# EAGLE schematic GH_Terra_pre_rf (EAGLE 6.5.0)
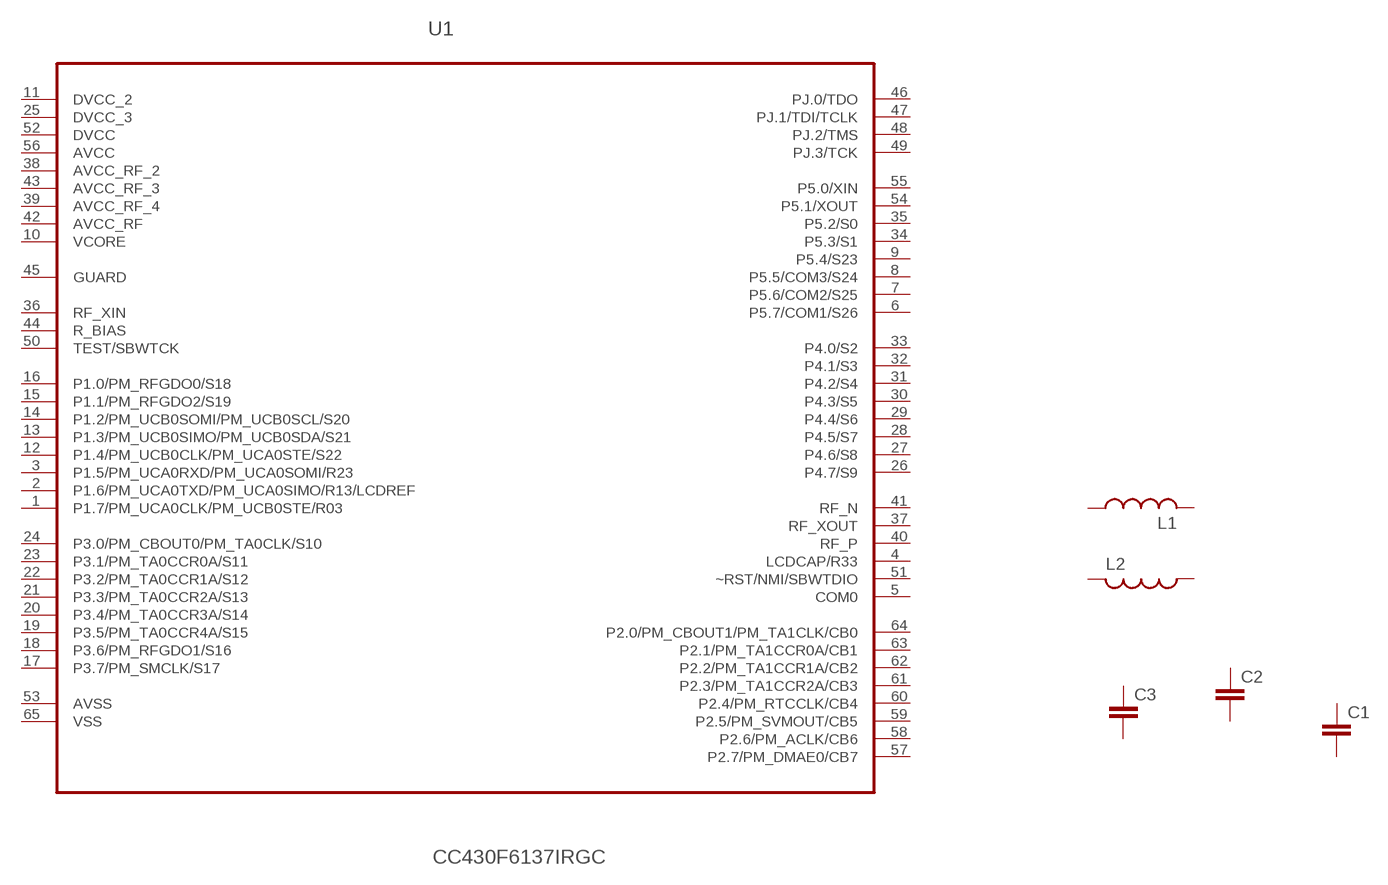
[diagram p0: schematic, sheet 1]

## Parts
C1  C-EUC0603  [C0603_IPC]
C2  C-EUC0603  [C0603_IPC]
C3  C-EUC0603  [C0603_IPC]
L1  L-USL0402  [L0402_IPC]
L2  L-USL0402  [L0402_IPC]
U1  CC430F6137IRGC  [QFN50P900X900X100-65N]
Unconnected: C1.1 C1.2 C2.1 C2.2 C3.1 C3.2 L1.1 L1.2 L2.1 L2.2 U1.1(P1.7/PM_UCA0CLK/PM_UCB0STE/R03) U1.2(P1.6/PM_UCA0TXD/PM_UCA0SIMO/R13/LCDREF) U1.3(P1.5/PM_UCA0RXD/PM_UCA0SOMI/R23) U1.4(LCDCAP/R33) U1.5(COM0) U1.6(P5.7/COM1/S26) U1.7(P5.6/COM2/S25) U1.8(P5.5/COM3/S24) U1.9(P5.4/S23) U1.12(P1.4/PM_UCB0CLK/PM_UCA0STE/S22) U1.13(P1.3/PM_UCB0SIMO/PM_UCB0SDA/S21) U1.14(P1.2/PM_UCB0SOMI/PM_UCB0SCL/S20) U1.15(P1.1/PM_RFGDO2/S19) U1.16(P1.0/PM_RFGDO0/S18) U1.17(P3.7/PM_SMCLK/S17) U1.18(P3.6/PM_RFGDO1/S16) U1.19(P3.5/PM_TA0CCR4A/S15) U1.20(P3.4/PM_TA0CCR3A/S14) U1.21(P3.3/PM_TA0CCR2A/S13) U1.22(P3.2/PM_TA0CCR1A/S12) U1.23(P3.1/PM_TA0CCR0A/S11) U1.24(P3.0/PM_CBOUT0/PM_TA0CLK/S10) U1.26(P4.7/S9) U1.27(P4.6/S8) U1.28(P4.5/S7) U1.29(P4.4/S6) U1.30(P4.3/S5) U1.31(P4.2/S4) U1.32(P4.1/S3) U1.33(P4.0/S2) U1.34(P5.3/S1) U1.35(P5.2/S0) U1.36(RF_XIN) U1.37(RF_XOUT) U1.40(RF_P) U1.41(RF_N) U1.44(R_BIAS) U1.45(GUARD) U1.46(PJ.0/TDO) U1.47(PJ.1/TDI/TCLK) U1.48(PJ.2/TMS) U1.49(PJ.3/TCK) U1.50(TEST/SBWTCK) U1.51(~RST/NMI/SBWTDIO) U1.53(AVSS) U1.54(P5.1/XOUT) U1.55(P5.0/XIN) U1.57(P2.7/PM_DMAE0/CB7) U1.58(P2.6/PM_ACLK/CB6) U1.59(P2.5/PM_SVMOUT/CB5) U1.60(P2.4/PM_RTCCLK/CB4) U1.61(P2.3/PM_TA1CCR2A/CB3) U1.62(P2.2/PM_TA1CCR1A/CB2) U1.63(P2.1/PM_TA1CCR0A/CB1) U1.64(P2.0/PM_CBOUT1/PM_TA1CLK/CB0) U1.65(VSS)

## Power pins joined to a net without a drawn wire
AVCC: U1.56(AVCC)
AVCC_RF: U1.42(AVCC_RF)
AVCC_RF_2: U1.38(AVCC_RF_2)
AVCC_RF_3: U1.43(AVCC_RF_3)
AVCC_RF_4: U1.39(AVCC_RF_4)
DVCC: U1.52(DVCC)
DVCC_2: U1.11(DVCC_2)
DVCC_3: U1.25(DVCC_3)
VCORE: U1.10(VCORE)

## Library data of the parts
C1-C3 = rcl:C-EU: CAPACITOR, European symbol
L1 L2 = rcl:L-US: INDUCTOR, American symbol
U1 = Texas Instruments_By_element14_Batch_1:CC430F6137IRGC: MSP430 SoC with RF Core; MPN: CC430F6137IRGC; OC_FARNELL: 1903416; OC_NEWARK: 68R5921; PACKAGE: VQFN-64; SUPPLIER: TEXAS INSTRUMENTS